# EAGLE design furball-mini (EAGLE 9.4.2)
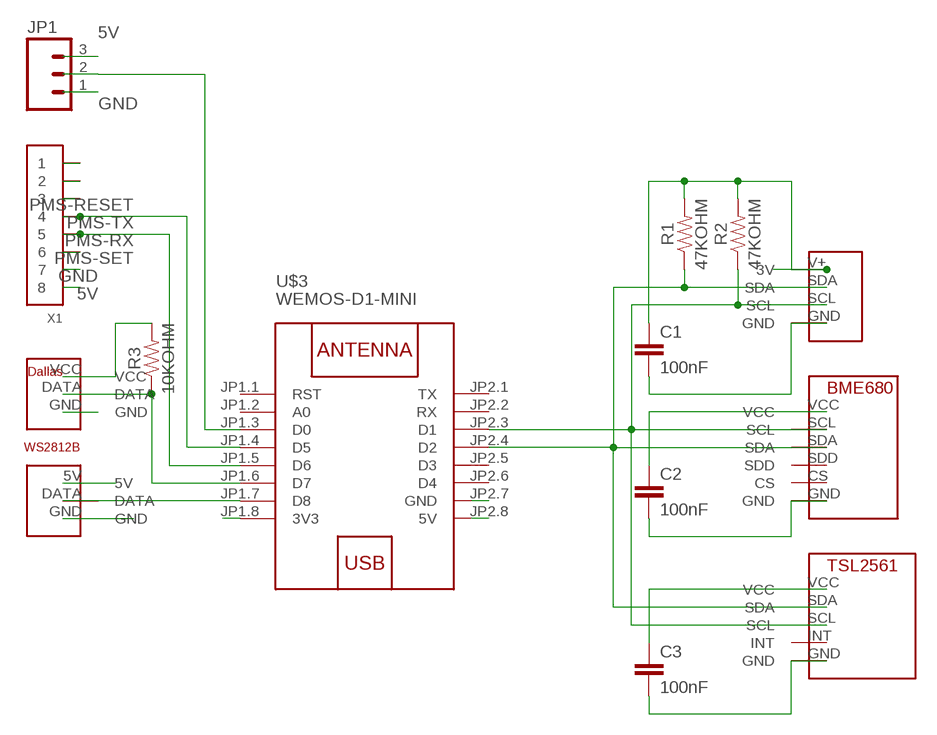
[diagram p0: schematic, sheet 1]

## Parts
C1  100nF  CAPPTH3  [CAP-PTH-LARGE]
C2  100nF  CAPPTH3  [CAP-PTH-LARGE]
C3  100nF  CAPPTH3  [CAP-PTH-LARGE]
JP1  M03PTH  [1X03]
R1  47KOHM  [AXIAL-0.3-KIT]
R2  47KOHM  [AXIAL-0.3-KIT]
R3  10KOHM  47KOHM  [AXIAL-0.3-KIT]
U$1  WS2812BHEADER  [WS2812BHEADER]
U$2  I2CHEADER  [I2CHEADER]
U$3  WEMOS-D1-MINI  [WEMOS-D1-MINI]
U$4  BME680BREAKOUT  [BME680BREAKOUT]
U$5  DALLASONEWIREHEADER  [DALLASONEWIREHEADER]
U$6  TSL2561BREAKOUT  [TSL2561BREAKOUT]
X1  CONN_8-1-53261  [PB-53261-08]

## Nets
3V3: C1.1 C2.1 C3.1 R1.P$2 R2.P$2 R3.P$2 U$2.V+(3V) U$3.JP1.8(3V3) U$4.VCC U$5.VCC U$6.VCC
5V: JP1.3 U$1.5V U$3.JP2.8(5V) X1.8
GND: C1.2 C2.2 C3.2 JP1.1 U$1.GND U$2.GND U$3.JP2.7(GND) U$4.GND U$5.GND U$6.GND X1.7
N$1: R2.P$1 U$2.SCL U$3.JP2.3(D1) U$4.SCL U$6.SCL
N$2: R1.P$1 U$2.SDA U$3.JP2.4(D2) U$4.SDA U$6.SDA
N$3: U$1.DATA U$3.JP1.7(D8)
N$4: R3.P$1 U$3.JP1.6(D7) U$5.DATA
N$7: JP1.2 U$3.JP1.3(D0)
N$14: X1.2
N$15: X1.1
PMS-RESET: X1.3
PMS-RX: U$3.JP1.5(D6) X1.5
PMS-SET: X1.6
PMS-TX: U$3.JP1.4(D5) X1.4
Unconnected: U$3.JP1.1(RST) U$3.JP1.2(A0) U$3.JP2.1(TX) U$3.JP2.2(RX) U$3.JP2.5(D3) U$3.JP2.6(D4) U$4.CS U$4.SDD U$6.INT

## Library data of the parts
C1-C3 = SparkFun:CAP: Capacitor Standard 0603 ceramic capacitor, and 0.1" leaded capacitor.
JP1 = SparkFun:M03: Header 3 Standard 3-pin 0.1" header. Use with straight break away headers (SKU : PRT-00116), right angle break away headers (PRT-00553), swiss pins (PRT-00743), machine pins (PRT-00117), and female headers (PRT-00115). Molex polarized connector foot print use with SKU : PRT-08232 with associated crimp pins and housings.
R1-R3 = LOLIN32:47KOHM: 47kΩ resistor A resistor is a passive two-terminal electrical component that implements electrical resistance as a circuit element. Resistors act to reduce current flow, and, at the same time, act to lower voltage levels within circuits. - Wikipedia
U$1 = LOLIN32:WS2812BHEADER: WS2812B RGB LED header
U$2 = LOLIN32:I2CHEADER
U$3 = diy-modules:WEMOS-D1-MINI: WEMOS D1 mini: Mini Wi-Fi Board based on ESP-8266 device More details can be found here: https://www.wemos.cc/product/d1-mini.html Click here to find device on ebay.com <http://www.ebay.com/sch/wemos+d1+mini+nodemcu>
U$4 = LOLIN32:BME680BREAKOUT
U$5 = LOLIN32:DALLASONEWIREHEADER
U$6 = LOLIN32:TSL2561BREAKOUT
X1 = pel_molex:CONN_8-1

## Net classes
1 GROUND: width 0.229 mm
3 5V: width 0.229 mm

## Board
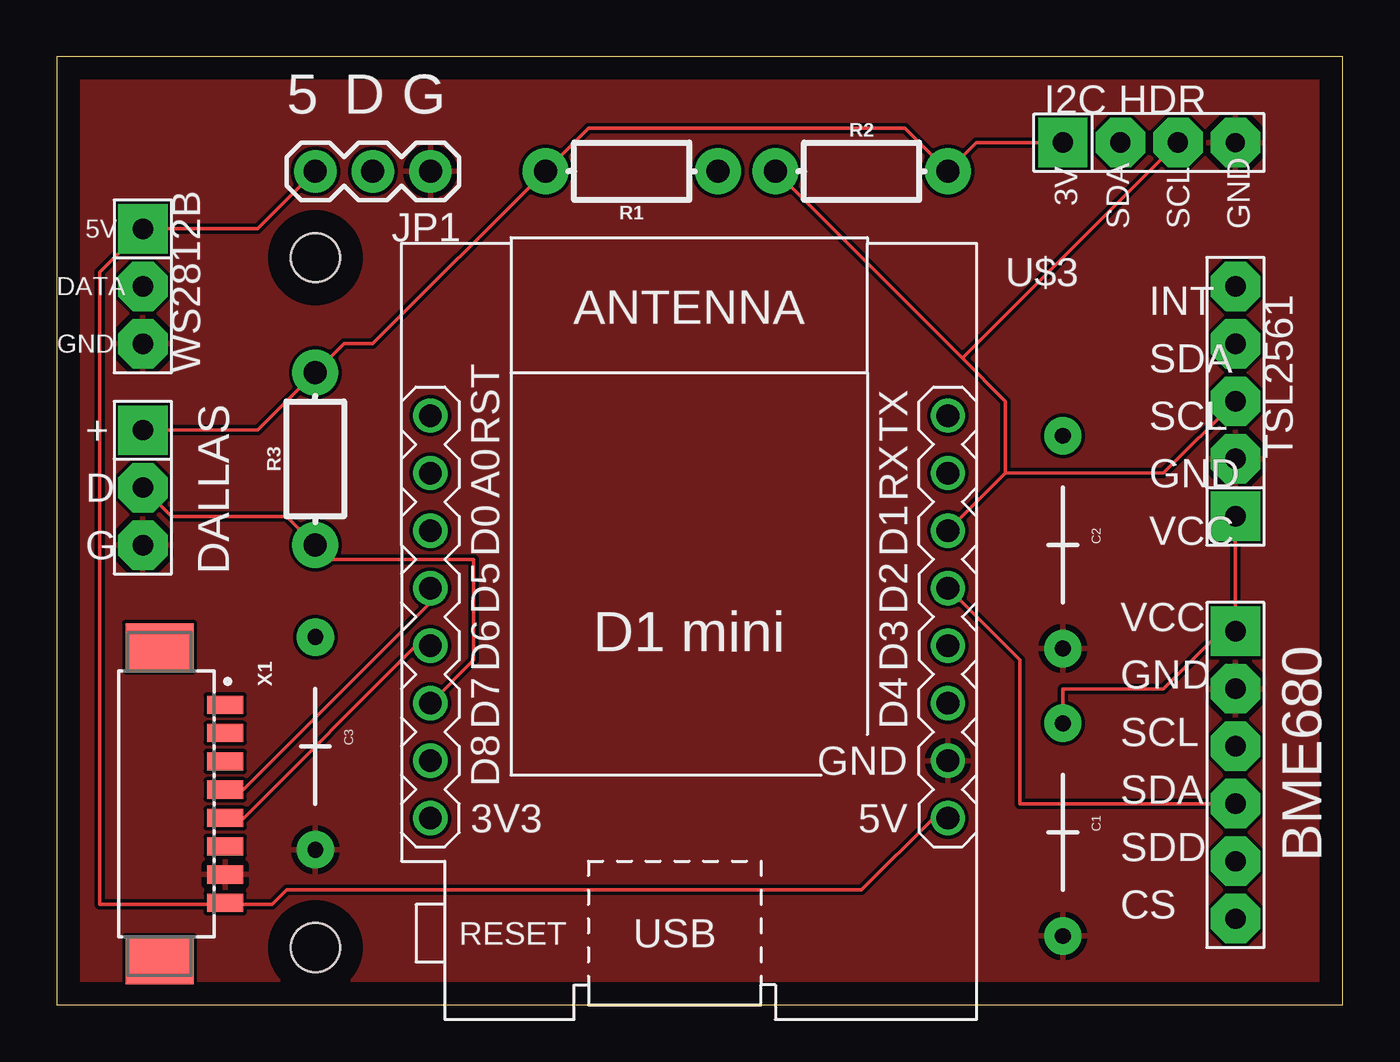
[diagram p1: board, top side]
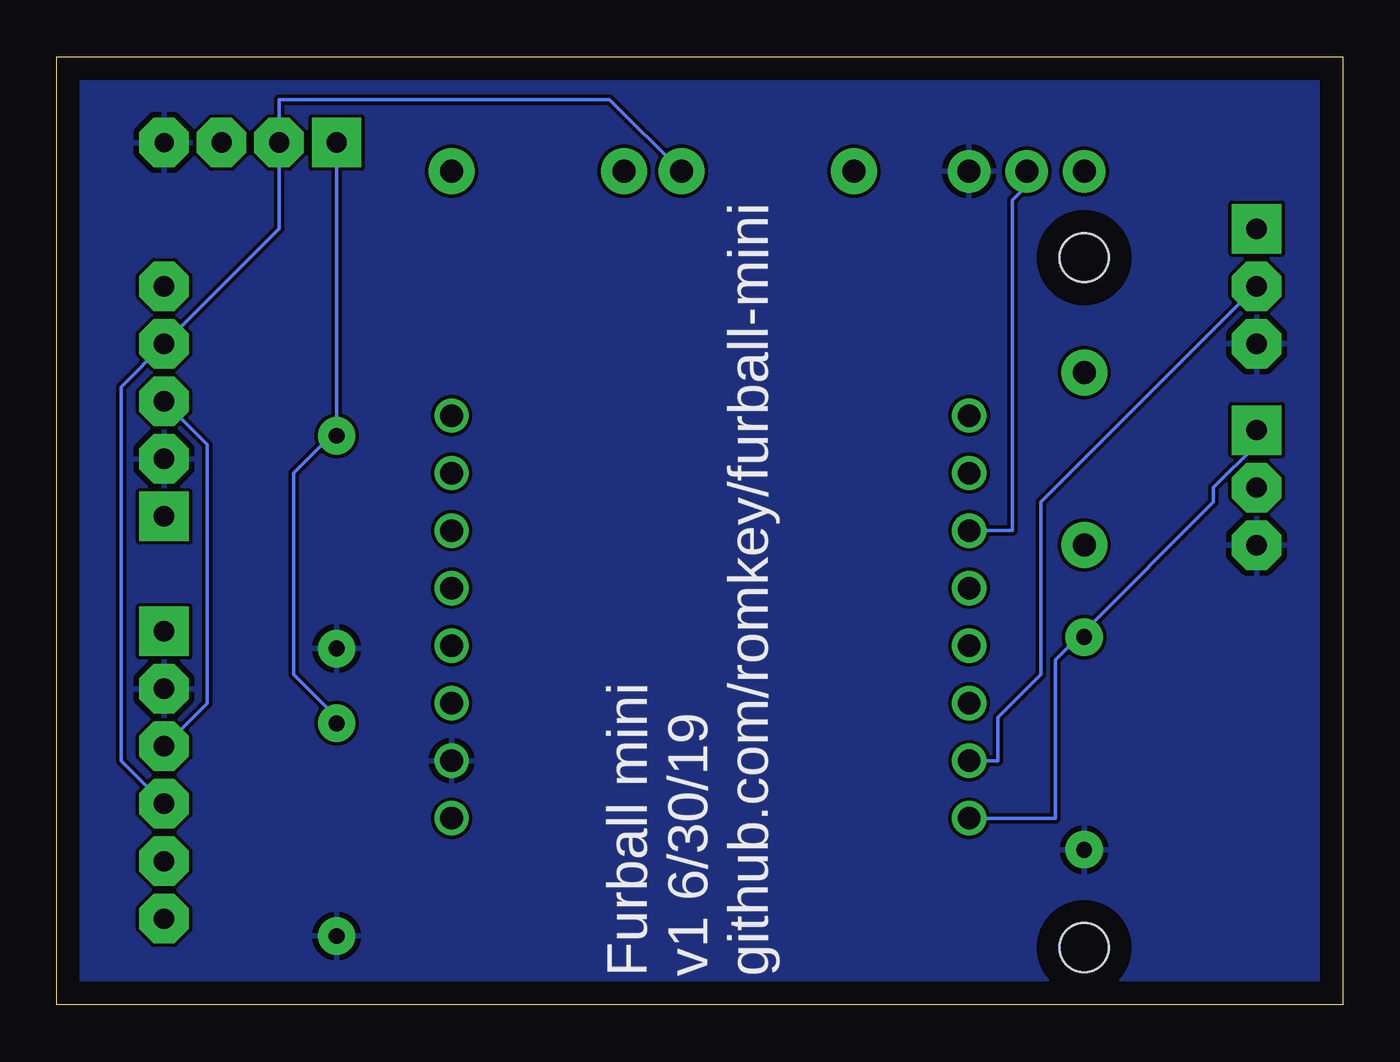
[diagram p2: board, bottom side, seen from below]

Size 56.82 x 41.9 mm. Coordinates in mm from the lower left corner, seen from the top.
Outline: 0,0 56.82,0 56.82,41.9 0,41.9 0,0
Copper layers (1*16): Top 0.035mm / dielectric 1.5mm / Bottom 0.035mm
Design rules "default": minimum track width 6mil, minimum drill 0.35mm, track to track 6mil, track to pad 6mil, pad to pad 6mil, via to via 6mil, smd to smd 6mil, copper to edge 40mil, drill to drill 6mil, minimum pad ring 10mil, minimum via ring 8mil, stop-mask expansion 4mil, vias tented up to drill 0mil, thermal gap 10mil
Holes 2.16 mm at 11.43,33.02 11.43,2.54

### Footprints (pad centres in the part's own frame; a part is rotated, then mirrored left to right if it is on the bottom)
CAP-PTH-LARGE = drill 0.7 pad 1.651: 1 -4.826,0; 2 4.572,0
1X03 = drill 1.016 pad 1.88: 1 0,0; 2 2.54,0; 3 5.08,0
AXIAL-0.3-KIT = drill 1.016 pad 2.032: P$1 -3.81,0; P$2 3.81,0
WS2812BHEADER = drill 0.9 pad 2.184 square: 5V -2.54,7.62 | drill 0.9 pad 2.184 octagon: DATA -2.54,5.08; GND -2.54,2.54
I2CHEADER = drill 0.85 pad 2.184 octagon: GND 3.81,1.27 | drill 0.9 pad 2.184 octagon: SCL 3.81,3.81; SDA 3.81,6.35 | drill 0.9 pad 2.184 square: V+ 3.81,8.89
WEMOS-D1-MINI = drill 1: JP1.1 -11.43,9.525; JP1.2 -11.43,6.985; JP1.3 -11.43,4.445; JP1.4 -11.43,1.905; JP1.5 -11.43,-0.635; JP1.6 -11.43,-3.175; JP1.7 -11.43,-5.715; JP1.8 -11.43,-8.255; JP2.1 11.43,9.525; JP2.2 11.43,6.985; JP2.3 11.43,4.445; JP2.4 11.43,1.905; JP2.5 11.43,-0.635; JP2.6 11.43,-3.175; JP2.7 11.43,-5.715; JP2.8 11.43,-8.255
BME680BREAKOUT = drill 0.9 pad 2.184 octagon: CS 2.54,2.54; GND 2.54,12.7; SCL 2.54,10.16; SDA 2.54,7.62; SDD 2.54,5.08 | drill 0.9 pad 2.184 square: VCC 2.54,15.24
DALLASONEWIREHEADER = drill 0.9 pad 2.184 octagon: DATA 2.54,3.81; GND 2.54,1.27 | drill 0.9 pad 2.184 square: VCC 2.54,6.35
TSL2561BREAKOUT = drill 0.9 pad 2.184 octagon: GND 3.81,3.81; INT 3.81,11.43; SCL 3.81,6.35; SDA 3.81,8.89 | drill 0.9 pad 2.184 square: VCC 3.81,1.27
PB-53261-08 = smd 0.8 x 1.6: 1 -4.375,1.1; 2 -3.125,1.1; 3 -1.875,1.1; 4 -0.625,1.1; 5 0.625,1.1; 6 1.875,1.1; 7 3.125,1.1; 8 4.375,1.1 | smd 2.1 x 3: MNT1 -6.925,-1.8; MNT2 6.925,-1.8

### Placement (x,y rotation side)
C1  44.45,7.62 270 top
C2  44.45,20.32 270 top
C3  11.43,11.43 270 top
JP1  16.51,36.83 180 top
R1  25.4,36.83 180 top
R2  35.56,36.83 0 top
R3  11.43,24.13 90 top
U$1  6.35,26.67 0 top
U$2  53.34,34.29 90 top
U$3  27.94,16.51 0 top
U$4  49.53,1.27 0 top
U$5  1.27,19.05 0 top
U$6  48.26,20.32 0 top
X1  6.35,8.89 270 top

### Tracks (layer width: path | path; a pad name or v marks a point on that pad's centre or on a via)
3V3
  Top 0.152: C1.1 44.45,13.97 48.9,13.97 51.44,16.51 U$4.VCC U$6.VCC | U$2.V+ 40.64,38.1 R2.P$2 37.47,38.73 23.5,38.73 R1.P$2 13.97,29.21 12.7,29.21 R3.P$2 8.89,25.4 U$5.VCC
  Bottom 0.152: U$2.V+ 44.45,25.4 | 44.45,25.4 46.35,23.5 46.35,14.61 44.45,12.7 C1.1 | 44.45,25.4 C2.1 | U$3.JP1.8 12.7,8.26 12.7,15.24 11.43,16.51 | 11.43,16.51 5.71,22.23 5.71,22.86 3.81,24.77 U$5.VCC | 11.43,16.51 C3.1
5V
  Top 0.152: JP1.3 8.89,34.29 U$1.5V 1.91,32.38 1.91,4.45 6.99,4.45 X1.8 7.62,4.45 9.53,4.45 10.16,5.08 35.56,5.08 38.73,8.26 U$3.JP2.8
GND
  pour Top: 0,41.91 0,0 57.15,0 57.15,41.91
  pour Bottom: 0,41.91 0,0 57.15,0 57.15,41.91
N$1
  Top 0.152: 41.91,23.5 U$3.JP2.3 | 41.91,23.5 48.9,23.5 U$6.SCL | 40.01,28.57 41.91,26.67 41.91,23.5 | 40.01,28.57 R2.P$1 | 40.01,28.57 U$2.SCL
  Bottom 0.152: U$4.SCL 50.16,13.34 50.16,24.77 U$6.SCL
N$2
  Top 0.152: U$3.JP2.4 42.55,15.24 42.55,8.89 U$4.SDA
  Bottom 0.152: R1.P$1 32.38,40.01 46.99,40.01 U$2.SDA 46.99,34.29 U$6.SDA 53.98,27.3 53.98,10.79 U$4.SDA
N$3
  Bottom 0.152: U$3.JP1.7 15.24,10.79 15.24,12.7 13.34,14.61 13.34,22.23 U$1.DATA
N$4
  Top 0.152: U$3.JP1.6 18.41,15.24 18.41,19.68 12.06,19.68 R3.P$1 10.16,21.59 5.08,21.59 U$5.DATA
N$7
  Bottom 0.152: U$3.JP1.3 14.61,20.95 14.61,35.56 13.97,36.2 JP1.2
PMS-RX
  Top 0.152: U$3.JP1.5 15.88,15.88 8.26,8.26 7.62,8.26 X1.5
PMS-TX
  Top 0.152: U$3.JP1.4 16.51,17.78 8.26,9.53 7.62,9.53 X1.4

### Text on the board
tPlace: 5 | D | G | DALLAS
bPlace: Furball mini / v1 6/30/19 / github.com/romkey/furball-mini